# EAGLE design LS7366Rshield101 (EAGLE 6.5.0)
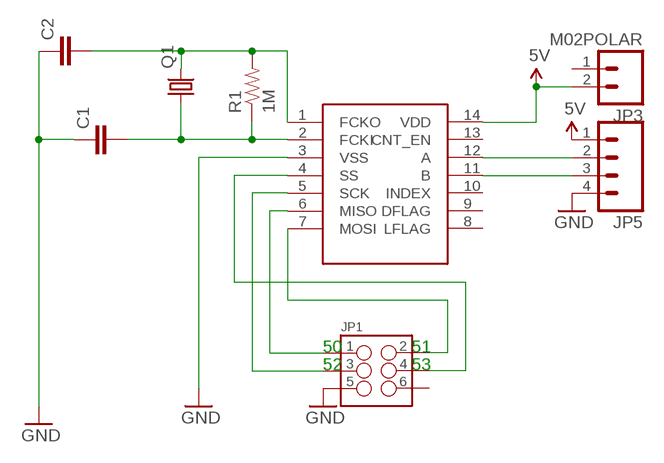
[diagram p0: schematic, sheet 1]

## Parts
C1  0.1UF-50V-20%(PTH)KIT-EZ  [CAP-PTH-SMALL-KIT]
C2  0.1UF-50V-20%(PTH)KIT-EZ  [CAP-PTH-SMALL-KIT]
JP1  M03X2POGO_PINS  [2X3_POGO]
JP3  M02POLAR  [MOLEX-1X2]
JP5  M04POLAR  [MOLEX-1X4]
LS7366R  LS7366R  [SO014]
Q1  CRYSTALHC49S  [HC49/S]
R1  1M  1KOHM-1/4W-1%(PTH)  [AXIAL-0.3]

## Nets
5V: JP3.2 JP5.1 LS7366R.14(VDD)
GND: C1.1 C2.1 JP1.P$5 JP5.4 LS7366R.3(VSS)
N$1: C1.2 LS7366R.2(FCKI) Q1.1 R1.P$1
N$2: C2.2 LS7366R.1(FCKO) Q1.2 R1.P$2
N$3: JP1.P$1 LS7366R.6(MISO)
N$4: JP1.P$4 LS7366R.4(SS)
N$7: JP1.P$2 LS7366R.7(MOSI)
N$8: JP1.P$3 LS7366R.5(SCK)
N$9: JP5.2 LS7366R.12(A)
N$10: JP5.3 LS7366R.11(B)
Unconnected: JP1.P$6 JP3.1 LS7366R.8(LFLAG) LS7366R.9(DFLAG) LS7366R.10(INDEX) LS7366R.13(CNT_EN)

## Notes on the sheet
- 50 | 51
- 52 | 53

## Library data of the parts
C1 C2 = SparkFun-Capacitors:0.1UF-50V-20%(PTH): CAP-08370; PROD_ID: CAP-08370
JP1 = SparkFun-Connectors:M03X2: 2x3 .1" header. Shrouded, with keying- CONN-10681 SMT- CONN-11415 Pogo pins- HW-11044; PROD_ID: HW-11044
JP3 = SparkFun-Connectors:M02: Standard 2-pin 0.1" header. Use with - straight break away headers ( PRT-00116) - right angle break away headers (PRT-00553) - swiss pins (PRT-00743) - machine pins (PRT-00117) - female headers (PRT-00115) Molex polarized connector foot print use with: PRT-08233 with associated crimp pins and housings. 2.54_SCREWTERM for use with PRT-10571. 3.5mm Screw Terminal footprints for PRT-08084 5mm Screw Terminal footprints for use with PRT-08432
JP5 = SparkFun-Connectors:M04: Header 4 Standard 4-pin 0.1" header. Use with straight break away headers (SKU : PRT-00116), right angle break away headers (PRT-00553), swiss pins (PRT-00743), machine pins (PRT-00117), and female headers (PRT-00115). Molex polarized connector foot print use with SKU : PRT-08231 with associated crimp pins and housings. 1MM SMD Version SKU: PRT-10208
LS7366R = SparkFun-DigitalIC:LS7366R
Q1 = crystal:CRYSTAL: CRYSTAL; OC_FARNELL: 1667008; OC_NEWARK: unknown
R1 = SparkFun-Resistors:1KOHM-1/4W-1%(PTH): RES-12182; PROD_ID: RES-12182; VALUE: 1K

## Board
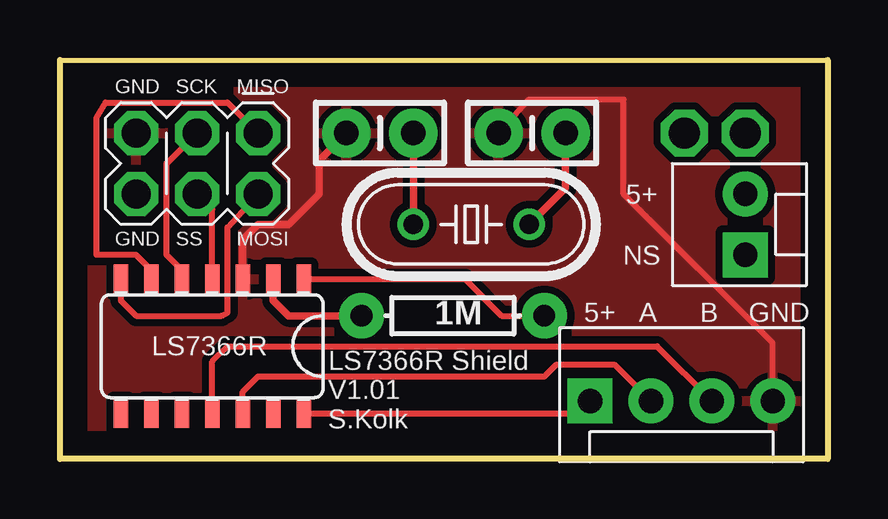
[diagram p1: board, top side]
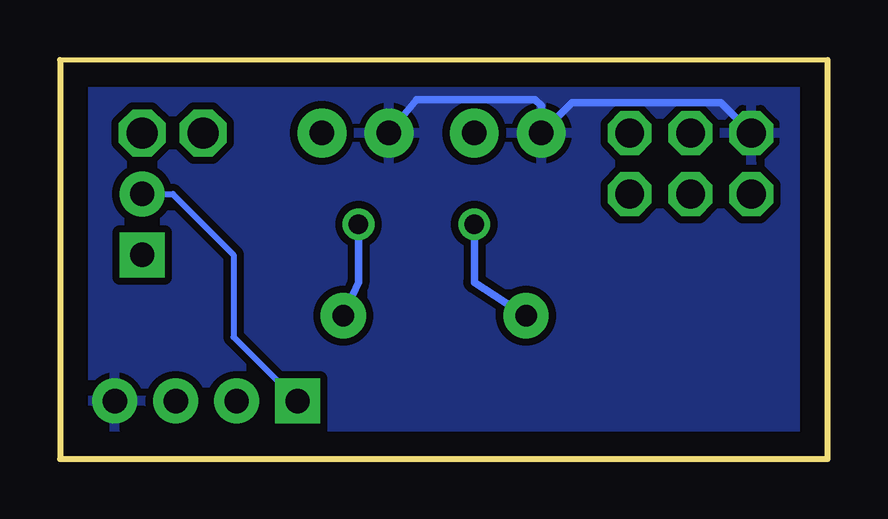
[diagram p2: board, bottom side, seen from below]

Size 32 x 16.64 mm. Coordinates in mm from the lower left corner, seen from the top.
Outline: 0,0 0,16.64 32,16.64 32,0 0,0
Copper layers (1*16): Top 0.035mm / dielectric 1.5mm / Bottom 0.035mm
Design rules "default": minimum track width 10mil, minimum drill 24mil, track to track 8mil, track to pad 8mil, pad to pad 8mil, via to via 8mil, smd to smd 8mil, copper to edge 40mil, drill to drill 8mil, minimum pad ring 10mil, minimum via ring 8mil, stop-mask expansion 4mil, vias tented up to drill 0mil, thermal gap 10mil

### Footprints (pad centres in the part's own frame; a part is rotated, then mirrored left to right if it is on the bottom)
CAP-PTH-SMALL-KIT = drill 1.016 pad 2.032: 1 -1.397,0; 2 1.397,0
2X3_POGO = drill 1.2 pad 1.829 octagon: P$1 0,0; P$2 0,2.54; P$3 2.54,0; P$4 2.54,2.54; P$5 5.08,0; P$6 5.08,2.54
MOLEX-1X2 = drill 1.016 pad 1.88 square: 1 0,0 | drill 1.016 pad 1.88: 2 2.54,0
MOLEX-1X4 = drill 1.016 pad 1.88 square: 1 0,0 | drill 1.016 pad 1.88: 2 2.54,0; 3 5.08,0; 4 7.62,0
SO014 = smd 0.6 x 1.2: 1 -3.175,-2.8; 2 -1.905,-2.8; 3 -0.635,-2.8; 4 0.635,-2.8; 5 1.905,-2.8; 6 3.175,-2.8; 7 4.445,-2.8; 8 4.445,2.8; 9 3.175,2.8; 10 1.905,2.8; 11 0.635,2.8; 12 -0.635,2.8; 13 -1.905,2.8; 14 -3.175,2.8
HC49/S = drill 0.813: 1 -2.413,0; 2 2.413,0
AXIAL-0.3 = drill 0.9 pad 1.88: P$1 -3.81,0; P$2 3.81,0

### Placement (x,y rotation side)
C1  13.34,13.59 0 top
C2  19.68,13.59 0 top
JP1  8.26,13.59 180 top
JP3  28.57,8.51 90 top
JP5  22.1,2.41 0 top
LS7366R  6.99,4.7 180 top
Q1  17.14,9.78 0 top
R1  16.38,5.97 0 top

### Tracks (layer width: path | path; a pad name or v marks a point on that pad's centre or on a via)
5V
  Top 0.254: LS7366R.14 21.58,1.9 JP5.1
  Bottom 0.254: JP3.2 27.3,11.05 24.77,8.51 24.77,5.08 JP5.1
GND
  Top 0.254: JP5.4 29.72,4.83 23.5,11.05 23.5,14.99 19.56,14.99 C2.1
  Top 0.305: LS7366R.3 7.62,9.14 8.26,9.78 9.53,9.78 10.79,11.05 10.79,12.45 C1.1
  Bottom 0.305: C2.1 17.14,14.99 12.19,14.99 11.94,14.73 C1.1 10.67,14.86 4.45,14.86 JP1.P$5
  pour Bottom (isolate 0.305): 0.13,16.38 31.88,16.38 31.88,0.13 0.13,0.13
  pour Top (isolate 0.305): 0,16.51 31.75,16.51 31.75,0 0,0
N$1
  Top 0.305: C1.2 Q1.1 | LS7366R.2 8.89,6.6 9.53,5.97 R1.P$1
  Bottom 0.305: Q1.1 14.73,7.37 R1.P$1
N$2
  Top 0.254: LS7366R.1 16.89,7.5 18.41,5.97 R1.P$2
  Top 0.305: C2.2 21.08,11.3 Q1.2
  Bottom 0.305: Q1.2 19.56,7.37 R1.P$2
N$3
  Top 0.254: LS7366R.6 3.81,7.87 3.17,8.51 1.52,8.51 1.52,14.22 1.91,14.86 6.99,14.86 JP1.P$1
N$4
  Top 0.254: LS7366R.4 6.35,10.41 JP1.P$4
N$7
  Top 0.254: LS7366R.7 2.54,6.6 3.17,5.97 6.73,5.97 6.99,6.1 6.99,9.65 JP1.P$2
N$8
  Top 0.254: LS7366R.5 5.08,7.87 4.45,8.51 4.45,12.32 JP1.P$3
N$9
  Top 0.254: LS7366R.12 7.62,2.79 8.26,3.43 20.19,3.43 20.7,3.94 23.11,3.94 JP5.2
N$10
  Top 0.254: LS7366R.11 6.35,4.06 6.99,4.7 24.89,4.7 JP5.3
N$17  (via drill 1.3)
  other vias: 26.04,13.59
N$18  (via drill 1.3)
  other vias: 28.57,13.59

### Text on the board
tPlace: GND | SCK | MISO | 5+ | GND | SS | MOSI | NS | 5+ | A | B | GND | LS7366R | LS7366R Shield / V1.01 / S.Kolk